# Altium project Pedaleira LPC2368.PrjPcb
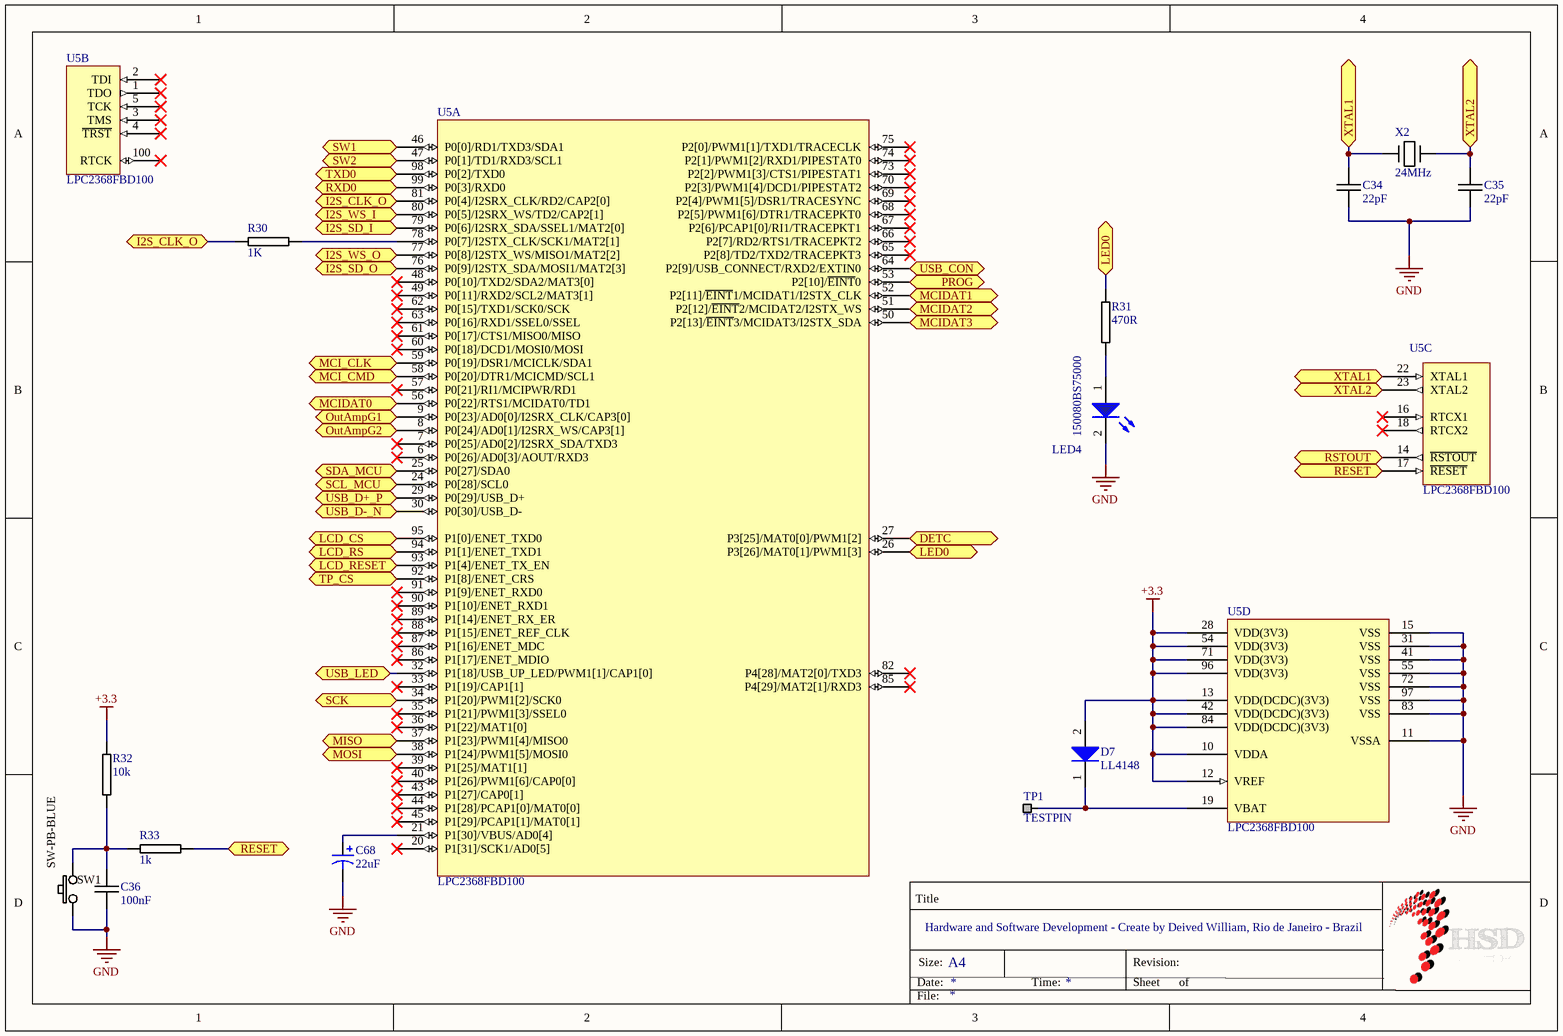
[diagram p0: MCU.SchDoc]
5 sheets, 121 parts. Net scope: flat (ports and power ports of the same name join across sheets).
Board file: PCB.PcbDoc
Sheets:
  MCU.SchDoc
  CODEC.SchDoc
  ISP.SchDoc
  LCD.SchDoc
  Alimentação.SchDoc

## Sheet MCU.SchDoc
size A4; Organization: Altium Limited; Address1: L3, 12a Rodborough Rd; Address2: Frenchs Forest; Address3: NSW; Address4: Australia 2086

### Parts
C34  22pF  [0603C-GENERIC]
C35  22pF  [0603C-GENERIC]
C36  100nF  [0603C-GENERIC]
C68  22uF  [D]
D7  LL4148  [MELFDIODE]
LED4  150080BS75000  [LED_0805_Blue]
R30  1K  [0603R-1k]
R31  470R  [0603R-1k]
R32  10k  [0603R-100]
R33  1k  [0603R-100]
SW1  SW-PB-BLUE  [SW-PB-BLUE-ROUND4]
TP1  TESTPIN  [TESTPIN]
U5  LPC2368FBD100  [SOT407-1_N]  (parts A,B,C,D of 4)
X2  24MHz  [XTAL-RU49/4]

### Ports
DETC, I2S_CLK_O, I2S_SD_I, I2S_SD_O, I2S_WS_I, I2S_WS_O, LCD_CS, LCD_RESET, LCD_RS, LED0, MCI_CLK, MCI_CMD, MCIDAT0, MCIDAT1, MCIDAT2, MCIDAT3, MISO, MOSI, OutAmpG1, OutAmpG2, PROG, RESET, RSTOUT, RXD0, SCK, SCL_MCU, SDA_MCU, SW1, SW2, TP_CS, TXD0, USB_CON, USB_D+_P, USB_D-_N, USB_LED, XTAL1, XTAL2

### Nets
+3.3: D7.2(A) R32.2 U5.10(VDDA) U5.12(VREF) U5.13(VDD(DCDC)(3V3)) U5.28(VDD(3V3)) U5.42(VDD(DCDC)(3V3)) U5.54(VDD(3V3)) U5.71(VDD(3V3)) U5.84(VDD(DCDC)(3V3)) U5.96(VDD(3V3))
GND: C34.2 C35.2 C36.2 C68.2 LED4.2(C) SW1.1 U5.11(VSSA) U5.15(VSS) U5.31(VSS) U5.41(VSS) U5.55(VSS) U5.72(VSS) U5.83(VSS) U5.97(VSS)
USB1_N: U5.30(P0[30]/USB_D-) ; port USB_D-_N
USB1_P: U5.29(P0[29]/USB_D+) ; port USB_D+_P
NetC34_1: C34.1 U5.22(XTAL1) X2.1 ; port XTAL1
NetC35_1: C35.1 U5.23(XTAL2) X2.2 ; port XTAL2
NetC36_1: C36.1 R32.1 R33.1 SW1.2
NetC63_1: U5.46(P0[0]/RD1/TXD3/SDA1) ; port SW1
NetC64_1: U5.47(P0[1]/TD1/RXD3/SCL1) ; port SW2
NetC68_1: C68.1 U5.21(P1[30]/VBUS/AD0[4])
NetD7_1: D7.1(K) TP1.1 U5.19(VBAT)
NetD9_2: U5.52(P2[11]/~{EINT}1/MCIDAT1/I2STX_CLK) ; port MCIDAT1
NetD10_2: U5.56(P0[22]/RTS1/MCIDAT0/TD1) ; port MCIDAT0
NetD11_2: U5.59(P0[19]/DSR1/MCICLK/SDA1) ; port MCI_CLK
NetD12_2: U5.58(P0[20]/DTR1/MCICMD/SCL1) ; port MCI_CMD
NetD13_2: U5.50(P2[13]/~{EINT}3/MCIDAT3/I2STX_SDA) ; port MCIDAT3
NetD14_2: U5.51(P2[12]/~{EINT}2/MCIDAT2/I2STX_WS) ; port MCIDAT2
NetJ1_11: U5.27(P3[25]/MAT0[0]/PWM1[2]) ; port DETC
NetLED1_2: U5.98(P0[2]/TXD0) ; port TXD0
NetLED2_2: U5.32(P1[18]/USB_UP_LED/PWM1[1]/CAP1[0]) ; port USB_LED
NetLED3_2: U5.99(P0[3]/RXD0) ; port RXD0
NetLED4_1: LED4.1(A) R31.2
NetP4_1: R33.2 U5.17(~{RESET}) ; port RESET
NetP4_3: U5.53(P2[10]/~{EINT}0) ; port PROG
NetP5_13: U5.93(P1[4]/ENET_TX_EN) ; port LCD_RESET
NetP5_15: U5.94(P1[1]/ENET_TXD1) ; port LCD_RS
NetP5_19: U5.38(P1[24]/PWM1[5]/MOSI0) ; port MOSI
NetP5_21: U5.37(P1[23]/PWM1[4]/MISO0) ; port MISO
NetP5_23: U5.34(P1[20]/PWM1[2]/SCK0) ; port SCK
NetP5_24: U5.95(P1[0]/ENET_TXD0) ; port LCD_CS
NetP5_26: U5.92(P1[8]/ENET_CRS) ; port TP_CS
NetR17_2: U5.25(P0[27]/SDA0) ; port SDA_MCU
NetR18_2: U5.24(P0[28]/SCL0) ; port SCL_MCU
NetR29_1: U5.64(P2[9]/USB_CONNECT/RXD2/EXTIN0) ; port USB_CON
NetR30_1: R30.1 U5.81(P0[4]/I2SRX_CLK/RD2/CAP2[0]) ; port I2S_CLK_O
NetR30_2: R30.2 U5.78(P0[7]/I2STX_CLK/SCK1/MAT2[1])
NetR31_1: R31.1 U5.26(P3[26]/MAT0[1]/PWM1[3]) ; port LED0
NetU3_6: U5.76(P0[9]/I2STX_SDA/MOSI1/MAT2[3]) ; port I2S_SD_O
NetU3_7: U5.77(P0[8]/I2STX_WS/MISO1/MAT2[2]) ; port I2S_WS_O
NetU3_8: U5.79(P0[6]/I2SRX_SDA/SSEL1/MAT2[0]) ; port I2S_SD_I
NetU3_9: U5.80(P0[5]/I2SRX_WS/TD2/CAP2[1]) ; port I2S_WS_I
NetU3_23: U5.8(P0[24]/AD0[1]/I2SRX_WS/CAP3[1]) ; port OutAmpG2
NetU3_24: U5.9(P0[23]/AD0[0]/I2SRX_CLK/CAP3[0]) ; port OutAmpG1
NetU4_19: U5.14(~{RSTOUT}) ; port RSTOUT

Not connected (* = marked no-connect by the designer): U5 1(TDO)* 2(TDI)* 3(TMS)* 4(~{TRST})* 5(TCK)* 6(P0[26]/AD0[3]/AOUT/RXD3)* 7(P0[25]/AD0[2]/I2SRX_SDA/TXD3)* 16(RTCX1)* 18(RTCX2)* 20(P1[31]/SCK1/AD0[5])* 33(P1[19]/CAP1[1])* 35(P1[21]/PWM1[3]/SSEL0)* 36(P1[22]/MAT1[0])* 39(P1[25]/MAT1[1])* 40(P1[26]/PWM1[6]/CAP0[0])* 43(P1[27]/CAP0[1])* 44(P1[28]/PCAP1[0]/MAT0[0])* 45(P1[29]/PCAP1[1]/MAT0[1])* 48(P0[10]/TXD2/SDA2/MAT3[0])* 49(P0[11]/RXD2/SCL2/MAT3[1])* 57(P0[21]/RI1/MCIPWR/RD1)* 60(P0[18]/DCD1/MOSI0/MOSI)* 61(P0[17]/CTS1/MISO0/MISO)* 62(P0[15]/TXD1/SCK0/SCK)* 63(P0[16]/RXD1/SSEL0/SSEL)* 65(P2[8]/TD2/TXD2/TRACEPKT3)* 66(P2[7]/RD2/RTS1/TRACEPKT2)* 67(P2[6]/PCAP1[0]/RI1/TRACEPKT1)* 68(P2[5]/PWM1[6]/DTR1/TRACEPKT0)* 69(P2[4]/PWM1[5]/DSR1/TRACESYNC)* 70(P2[3]/PWM1[4]/DCD1/PIPESTAT2)* 73(P2[2]/PWM1[3]/CTS1/PIPESTAT1)* 74(P2[1]/PWM1[2]/RXD1/PIPESTAT0)* 75(P2[0]/PWM1[1]/TXD1/TRACECLK)* 82(P4[28]/MAT2[0]/TXD3)* 85(P4[29]/MAT2[1]/RXD3)* 86(P1[17]/ENET_MDIO)* 87(P1[16]/ENET_MDC)* 88(P1[15]/ENET_REF_CLK)* 89(P1[14]/ENET_RX_ER)* 90(P1[10]/ENET_RXD1)* 91(P1[9]/ENET_RXD0)* 100(RTCK)*

### Notes on the sheet
- Title
- Date:
- Size:
- Hardware and Software Development - Create by Deived William, Rio de Janeiro - Brazil
- A4
- Time:
- Revision:
- Sheet
- of
- File:

### Library data of the parts
C34 C35 = 0603C-22PF-50V-C0G-PAN: CAPACITOR 0603 CERAMIC; Manufacturer Part Number: ECJ-1VC1H220J; Manufacturer: Panasonic - ECG; Reel: C10; Tolerance: ±5%; Temperature Coefficient: C0G, NP0; Voltage - Rated: 50V; Supplier 1: Digi-Key; Features: General Purpose; Lead Spacing: -; Supplier: Digi-Key; Capacitance: 22pF; Packaging: Tape & Reel (TR); Mounting Type: Surface Mount, MLCC; RoHS: RoHS Compliant; Operating Temperature: -55°C ~ 125°C; Thickness: 0.80mm; Package / Case: 0603 (1608 metric); Category: Capacitors; Supplier Part Number 1: PCC220ACVTR-ND; Supplier Part Number: PCC220ACVTR-ND
C36 = 0603C-100NF-25V-X7R-TDK: CAPACITOR 0603 CERAMIC; Manufacturer Part Number: C1608X7R1E104K; Manufacturer: TDK Corporation; Reel: C12; Supplier 1: Digi-Key; Supplier Part Number 1: 445-1316-2-ND
C68 = CC106D004M: Conformal Coated Solid Tantalum Chip Capacitor: Standard Range, 10uF, 20% Tolerance, 4 WVDC @ -55°C to +85°C, Surge = 5V; Note: See Data Sheet for full range of components; Published: 19-Mar-2004; DatasheetDocument: 21-Mar-2002; PackageReference: D; Publisher: Altium Limited; ComponentLink1Description: Manufacturer Link; ComponentLink1URL: http://www.vishay.com/; ComponentLink2Description: Datasheet; ComponentLink2URL: http://www.vishay.com/docs/43017/ccec.pdf; Value: 10uF
D7 = 1N4148: Small Signal Fast Switching Diode
LED4 = WL-SMCW 0805  150080BS75000: SMD mono-color Chip LED, WL-SMCW, Blue; Manufacturer: W黵th Elektronik eiSos GmbH; PartNo: 150080BS75000; ComponentLink1Description: Manufacturer; ComponentLink1URL: http://www.we-online.de; Created by: Christin Otto; Created Date: June 2013; ComponentLink2Description: Datasheet; ComponentLink2URL: http://katalog.we-online.com/led/datasheet/150080BS75000.pdf; Color: Blue
R30 R31 = 0603R-1K: GENERIC RESISTOR 0603; Manufacturer Part Number: RMCF 1/16 1K 1% R; Manufacturer: Stackpole Electronics Inc; Reel: R14; Supplier 1: Digi-Key; Supplier Part Number 1: RMCF0603FT1K00TR-ND
R32 R33 = 0603R-100: GENERIC RESISTOR 0603; Manufacturer Part Number: RMCF 1/16 100 1% R; Manufacturer: Stackpole Electronics Inc; Reel: R24; Supplier 1: Digi-Key; Supplier Part Number 1: RMCF1/16100FRDKR-ND
SW1 = SW-PB-BLUE: SW-D6-R / SW-DS-S / SW-14X14 / SW-7X7
TP1 = TESTPIN: TESTPIN SINGLE PIN HEADER; Manufacturer 1: Sharon Long Industries; Manufacturer Part Number 1: Cut-it-yourself; Reel: TH; Supplier 1: Sharon Long Industries; Supplier 1 Part number: Cut-It-Yourself
U5 = LPC2368FBD100: ARM7 16/32-Bit Microcontroller, 512KB Flash, 58KB RAM, 4 Channel CAN, 100-Lead LQFP; Code_IEC: 136E20; Published: 17-Aug-2007; DatasheetVersion: rev.01, Jan-2007; PackageVersion: Feb-2003; PackageReference: SOT407-1; Publisher: Altium Limited; PackageDescription: 100-Pin Plastic Low Profile Quad Flat Pack, LQFP100; Code_JEDEC: MS-026; ComponentLink1Description: Manufacturer Link; ComponentLink1URL: http://www.nxp.com/; ComponentLink2Description: Datasheet; ComponentLink2URL: http://www.standardics.nxp.com/products/lpc2000/datasheet/lpc2364.lpc2366.lpc2368.pdf
X2 = 16MC-HC49US: 16MHZ CRSYTAL HC49US; Supplier 1: Mouser; Supplier Part Number 1: 815-ABLS-16.0M-T

## Sheet CODEC.SchDoc
size A4; Organization: Altium Limited; Address1: L3, 12a Rodborough Rd; Address2: Frenchs Forest; Address3: NSW; Address4: Australia 2086
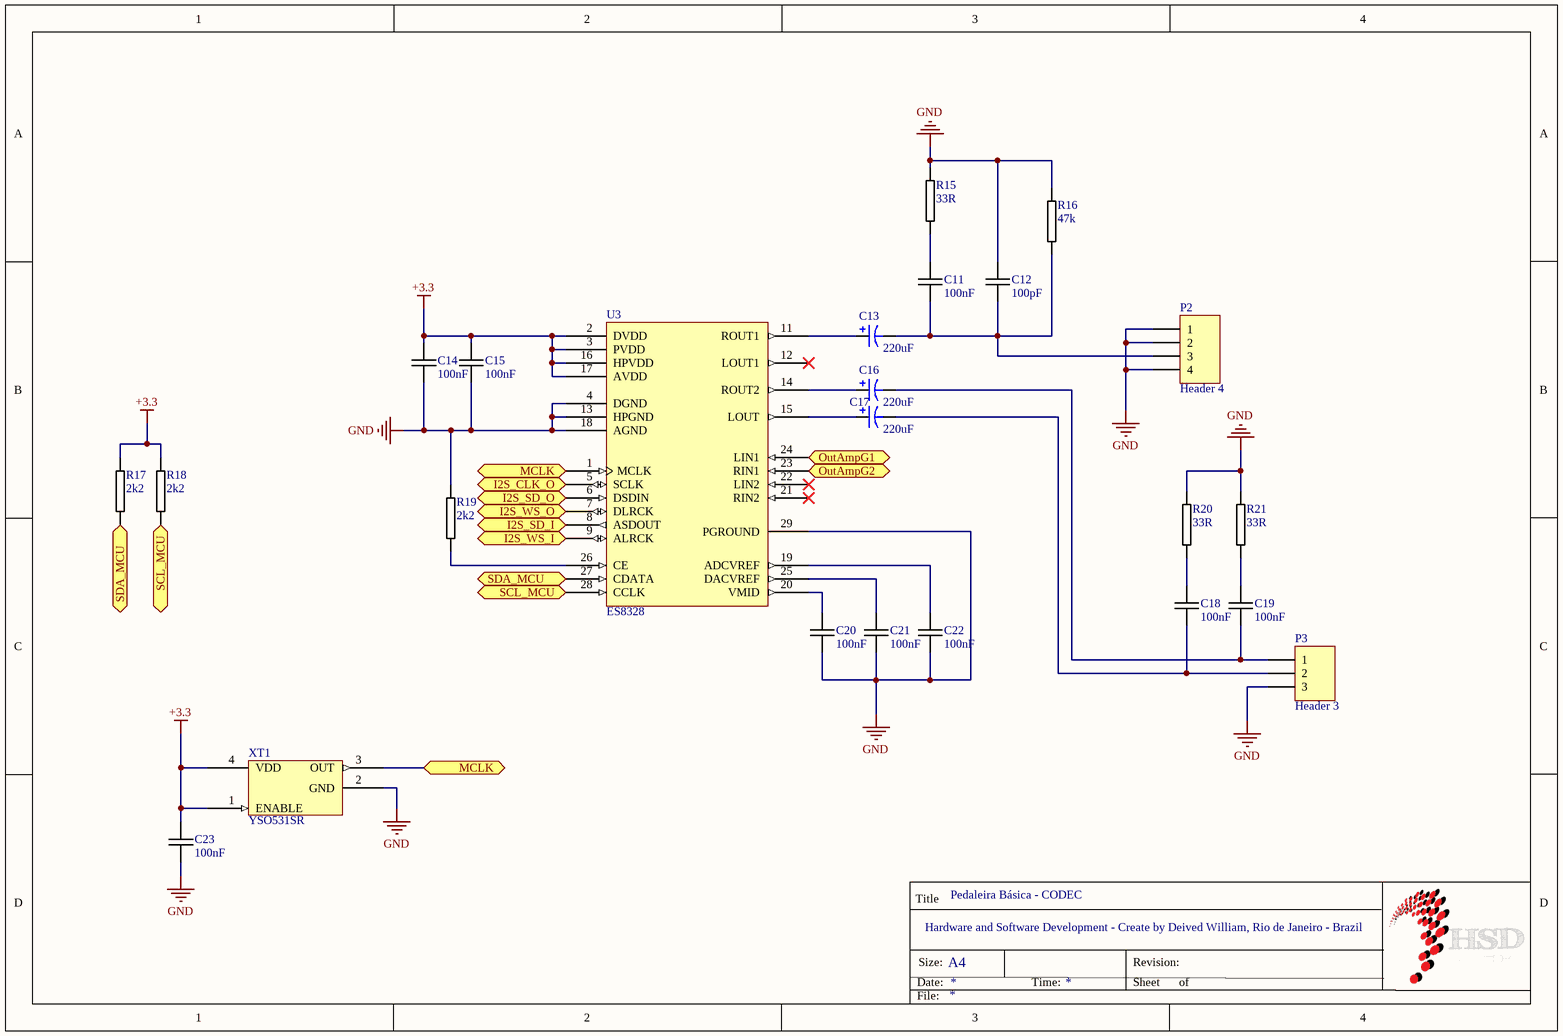
[diagram p1: CODEC.SchDoc]

### Parts
C11  100nF  [0603C-GENERIC]
C12  100pF  [0603C-GENERIC]
C13  220uF  [D]
C14  100nF  [0603C-GENERIC]
C15  100nF  [0603C-GENERIC]
C16  220uF  [D]
C17  220uF  [D]
C18  100nF  [0603C-GENERIC]
C19  100nF  [0603C-GENERIC]
C20  100nF  [0603C-GENERIC]
C21  100nF  [0603C-GENERIC]
C22  100nF  [0603C-GENERIC]
C23  100nF  [0603C-GENERIC]
P2  Header 4  [JACK P10 PLUG]
P3  Header 3  [HDR1X3]
R15  33R  [0603R-100]
R16  47k  [0603R-100]
R17  2k2  [0603R-100]
R18  2k2  [0603R-100]
R19  2k2  [0603R-100]
R20  33R  [0603R-100]
R21  33R  [0603R-100]
U3  ES8328  [QFN-28L]
XT1  YSO531SR  [CRISTAL]

### Ports
I2S_CLK_O, I2S_SD_I, I2S_SD_O, I2S_WS_I, I2S_WS_O, MCLK, OutAmpG1, OutAmpG2, SCL_MCU, SDA_MCU

### Nets
+3.3: C14.1 C15.1 C23.1 R17.1 R18.1 U3.2(DVDD) U3.3(PVDD) U3.16(HPVDD) U3.17(AVDD) XT1.1(ENABLE) XT1.4(VDD)
GND: C12.1 C14.2 C15.2 C20.2 C21.2 C22.2 C23.2 P2.1 P2.2 P2.4 P3.3 R15.1 R16.1 R19.2 R20.1 R21.1 U3.4(DGND) U3.13(HPGND) U3.18(AGND) U3.29(PGROUND) XT1.2(GND)
NetC11_1: C11.1 R15.2
NetC11_2: C11.2 C12.2 C13.2 P2.3 R16.2
NetC13_1: C13.1 U3.11(ROUT1)
NetC16_1: C16.1 U3.14(ROUT2)
NetC16_2: C16.2 C19.2 P3.1
NetC17_1: C17.1 U3.15(LOUT)
NetC17_2: C17.2 C18.2 P3.2
NetC18_1: C18.1 R20.2
NetC19_1: C19.1 R21.2
NetC20_1: C20.1 U3.20(VMID)
NetC21_1: C21.1 U3.25(DACVREF)
NetC22_1: C22.1 U3.19(ADCVREF)
NetR17_2: R17.2 U3.27(CDATA) ; port SDA_MCU
NetR18_2: R18.2 U3.28(CCLK) ; port SCL_MCU
NetR19_1: R19.1 U3.26(CE)
NetR30_1: U3.5(SCLK) ; port I2S_CLK_O
NetU3_1: U3.1(MCLK) XT1.3(OUT) ; port MCLK
NetU3_6: U3.6(DSDIN) ; port I2S_SD_O
NetU3_7: U3.7(DLRCK) ; port I2S_WS_O
NetU3_8: U3.8(ASDOUT) ; port I2S_SD_I
NetU3_9: U3.9(ALRCK) ; port I2S_WS_I
NetU3_23: U3.23(RIN1) ; port OutAmpG2
NetU3_24: U3.24(LIN1) ; port OutAmpG1

Not connected (* = marked no-connect by the designer): U3 12(LOUT1)* 21(RIN2)* 22(LIN2)*

### Notes on the sheet
- Pedaleira Básica - CODEC
- Title
- Date:
- Size:
- Hardware and Software Development - Create by Deived William, Rio de Janeiro - Brazil
- A4
- Time:
- Revision:
- Sheet
- of
- File:

### Library data of the parts
C11 C12 C14 C15 C18-C23 = 0603C-100NF-25V-X7R-TDK: as C36 on sheet MCU; Supplier 1: Digi-Key; Supplier Part Number 1: 445-1316-2-ND
C13 C16 C17 = CC106D004M: as C68 on sheet MCU; Published: 19-Mar-2004; DatasheetDocument: 21-Mar-2002; PackageReference: D; Publisher: Altium Limited; ComponentLink1Description: Manufacturer Link; ComponentLink1URL: http://www.vishay.com/; ComponentLink2Description: Datasheet; ComponentLink2URL: http://www.vishay.com/docs/43017/ccec.pdf; Value: 10uF
P2 = Header 4: Header, 4-Pin; LatestRevisionDate: 17-Jul-2002; LatestRevisionNote: Re-released for DXP Platform.; Publisher: Altium Limited
P3 = Header 3: Header, 3-Pin; LatestRevisionDate: 17-Jul-2002; LatestRevisionNote: Re-released for DXP Platform.; Publisher: Altium Limited
R15-R21 = 0603R-100: as R32 on sheet MCU; Supplier 1: Digi-Key; Supplier Part Number 1: RMCF1/16100FRDKR-ND
U3 = ES8328: Low Power Estereo Audio Codec With HeadPhone Amplifier
XT1 = YSO531SR: Cristal Oscilator Active 1.8v - 3.3v

## Sheet ISP.SchDoc
size A4; Organization: Altium Limited; Address1: L3, 12a Rodborough Rd; Address2: Frenchs Forest; Address3: NSW; Address4: Australia 2086
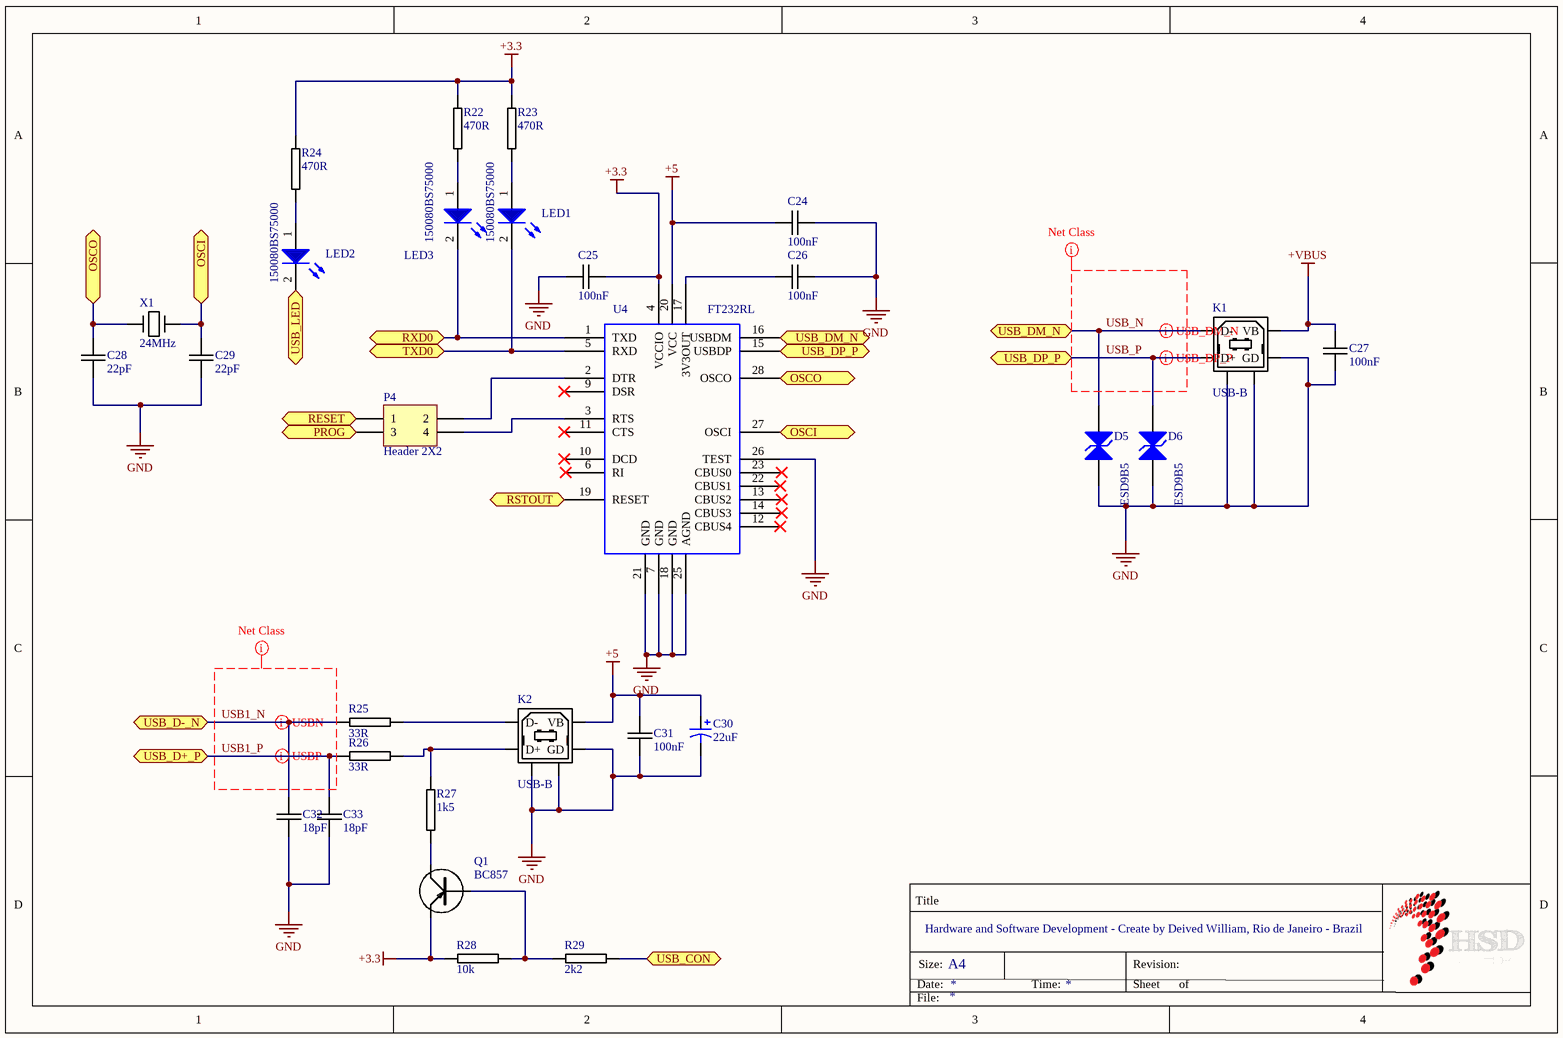
[diagram p2: ISP.SchDoc]

### Parts
C24  100nF  [0603C-GENERIC]
C25  100nF  [0603C-GENERIC]
C26  100nF  [0603C-GENERIC]
C27  100nF  [0603C-GENERIC]
C28  22pF  [0603C-GENERIC]
C29  22pF  [0603C-GENERIC]
C30  22uF  [D]
C31  100nF  [0603C-GENERIC]
C32  18pF  [0603C-GENERIC]
C33  18pF  [0603C-GENERIC]
D5  ESD9B5  [SOD-923]
D6  ESD9B5  [SOD-923]
K1  USB-B  [USB-B]
K2  USB-B  [USB-B]
LED1  150080BS75000  [LED_0805_Blue]
LED2  150080BS75000  [LED_0805_Blue]
LED3  150080BS75000  [LED_0805_Blue]
P4  Header 2X2  [HDR2X2]
Q1  BC857  [SOT23-BCE]
R22  470R  [0603R-1k]
R23  470R  [0603R-1k]
R24  470R  [0603R-1k]
R25  33R  [0603R-1k]
R26  33R  [0603R-1k]
R27  1k5  [0603R-1k]
R28  10k  [0603R-1k]
R29  2k2  [0603R-1k]
U4  FT232RL  [TSSOP28]
X1  24MHz  [XTAL-RU49/4]

### Ports
OSCI, OSCO, PROG, RESET, RSTOUT, RXD0, TXD0, USB_CON, USB_D+_P, USB_D-_N, USB_DM_N, USB_DP_P, USB_LED

### Nets
+3.3: C25.2 Q1.E R22.1 R23.1 R24.1 R28.2 U4.4(VCCIO)
+5: C24.2 C30.1 C31.1 K2.1(VB) U4.20(VCC)
+VBUS: C27.1 K1.1(VB)
GND: C24.1 C25.1 C26.1 C27.2 C28.2 C29.2 C30.2 C31.2 C32.2 C33.2 D5.1 D6.1 K1.4(GD) K1.5 K1.6 K2.4(GD) K2.5 K2.6 U4.7(GND) U4.18(GND) U4.21(GND) U4.25(AGND) U4.26(TEST)
USB1_N: C32.1 R25.1 ; port USB_D-_N
USB1_P: C33.1 R26.1 ; port USB_D+_P
USB_N: D5.2 K1.2(D-) U4.16(USBDM) ; port USB_DM_N
USB_P: D6.2 K1.3(D+) U4.15(USBDP) ; port USB_DP_P
NetC26_2: C26.2 U4.17(3V3OUT)
NetC28_1: C28.1 U4.28(OSCO) X1.1 ; port OSCO
NetC29_1: C29.1 U4.27(OSCI) X1.2 ; port OSCI
NetK2_2: K2.2(D-) R25.2
NetK2_3: K2.3(D+) R26.2 R27.2
NetLED1_1: LED1.1(A) R23.2
NetLED1_2: LED1.2(C) U4.5(RXD) ; port TXD0
NetLED2_1: LED2.1(A) R24.2
NetLED2_2: LED2.2(C) ; port USB_LED
NetLED3_1: LED3.1(A) R22.2
NetLED3_2: LED3.2(C) U4.1(TXD) ; port RXD0
NetP4_1: P4.1 ; port RESET
NetP4_2: P4.2 U4.2(DTR)
NetP4_3: P4.3 ; port PROG
NetP4_4: P4.4 U4.3(RTS)
NetQ1_B: Q1.B R28.1 R29.2
NetQ1_C: Q1.C R27.1
NetR29_1: R29.1 ; port USB_CON
NetU4_19: U4.19(RESET) ; port RSTOUT

Not connected (* = marked no-connect by the designer): U4 6(RI) 9(DSR)* 10(DCD)* 11(CTS)* 12(CBUS4)* 13(CBUS2) 14(CBUS3) 22(CBUS1)* 23(CBUS0)

### Layout directives
net class Undefined: USB1_N, USB1_P, USB_N, USB_P
differential pair; rule Undefined; rule Differential Pairs Routing [Pref Gap = 10mil    Min Gap  = 10mil    Max Gap  = 10milPref Width = 15mil    Min Width  = 15mil    Max Width  = 15mil]; rule Differential Pairs Routing [Pref Gap = 0.254mm    Min Gap  = 0.254mm    Max Gap  = 0.254mmPref Width = 0.381mm    Min Width  = 0.381mm    Max Width  = 0.381mm]: USB_N
differential pair; rule Differential Pairs Routing [Pref Gap = 10mil    Min Gap  = 10mil    Max Gap  = 10milPref Width = 15mil    Min Width  = 15mil    Max Width  = 15mil]; rule Differential Pairs Routing [Pref Gap = 10mil    Min Gap  = 10mil    Max Gap  = 10milPref Width = 15mil    Min Width  = 15mil    Max Width  = 15mil]: USB_P
differential pair; rule Differential Pairs Routing [Pref Gap = 10mil    Min Gap  = 10mil    Max Gap  = 10milPref Width = 15mil    Min Width  = 15mil    Max Width  = 15mil]; : USB_D-_N; rule Differential Pairs Routing [Pref Gap = 0.254mm    Min Gap  = 0.254mm    Max Gap  = 0.254mmPref Width = 0.381mm    Min Width  = 0.381mm    Max Width  = 0.381mm]: USB1_N
differential pair; rule Differential Pairs Routing [Pref Gap = 10mil    Min Gap  = 10mil    Max Gap  = 10milPref Width = 15mil    Min Width  = 15mil    Max Width  = 15mil]; : USB_D+_P; rule Differential Pairs Routing [Pref Gap = 0.254mm    Min Gap  = 0.254mm    Max Gap  = 0.254mmPref Width = 0.381mm    Min Width  = 0.381mm    Max Width  = 0.381mm]: USB1_P

### Notes on the sheet
- Title
- Date:
- Size:
- Hardware and Software Development - Create by Deived William, Rio de Janeiro - Brazil
- A4
- Time:
- Revision:
- Sheet
- of
- File:

### Library data of the parts
C24-C26 C31-C33 = 0603C-22PF-50V-C0G-PAN: CAPACITOR 0603 CERAMIC; Manufacturer Part Number: ECJ-1VC1H220J; Manufacturer: Panasonic - ECG; Reel: C10; Tolerance: ±5%; Capacitance: 22pF; Temperature Coefficient: C0G, NP0; Voltage - Rated: 50V; Supplier 1: Digi-Key; Features: General Purpose; Lead Spacing: -; Supplier: Digi-Key; Packaging: Tape & Reel (TR); Mounting Type: Surface Mount, MLCC; RoHS: RoHS Compliant; Operating Temperature: -55°C ~ 125°C; Thickness: 0.80mm; Package / Case: 0603 (1608 metric); Category: Capacitors; Supplier Part Number 1: PCC220ACVTR-ND; Supplier Part Number: PCC220ACVTR-ND
C27 = 0603C-100NF-25V-X7R-TDK: as C36 on sheet MCU; Supplier 1: Digi-Key; Supplier Part Number 1: 445-1316-2-ND
C28 C29 = 0603C-22PF-50V-C0G-PAN: as C34 on sheet MCU; Supplier 1: Digi-Key; Features: General Purpose; Lead Spacing: -; Supplier: Digi-Key; Capacitance: 22pF; Packaging: Tape & Reel (TR); Mounting Type: Surface Mount, MLCC; RoHS: RoHS Compliant; Operating Temperature: -55°C ~ 125°C; Thickness: 0.80mm; Package / Case: 0603 (1608 metric); Category: Capacitors; Supplier Part Number 1: PCC220ACVTR-ND; Supplier Part Number: PCC220ACVTR-ND
C30 = CC106D004M: as C68 on sheet MCU; Published: 19-Mar-2004; DatasheetDocument: 21-Mar-2002; PackageReference: D; Publisher: Altium Limited; ComponentLink1Description: Manufacturer Link; ComponentLink1URL: http://www.vishay.com/; ComponentLink2Description: Datasheet; ComponentLink2URL: http://www.vishay.com/docs/43017/ccec.pdf; Value: 10uF
D5 D6 = ESD9B5: ESD PROTECTION DIODE
K1 K2 = USB-B: USB B DEVICE CONNECTOR; Text Field1: Assmann; Text Field2: AU-Y1007; Text Field3: Digi-Key; Text Field4: AE1085-ND; Text Field5: Thru-Hole; Text Field6: 1.168; NI?: *; O?: *; Section:: *
LED1-LED3 = WL-SMCW 0805  150080BS75000: as LED4 on sheet MCU; PartNo: 150080BS75000; ComponentLink1Description: Manufacturer; ComponentLink1URL: http://www.we-online.de; Created by: Christin Otto; Created Date: June 2013; ComponentLink2Description: Datasheet; ComponentLink2URL: http://katalog.we-online.com/led/datasheet/150080BS75000.pdf; Color: Blue
P4 = Header 2X2: Header, 2-Pin, Dual row; LatestRevisionDate: 17-Jul-2002; LatestRevisionNote: Re-released for DXP Platform.; Publisher: Altium Limited
Q1 = BC857: BC857 SMALL SIGNAL PNP BIPOLAR TRANSISTOR; Manufacturer: Diodes Inc; Manufacturer Part Number: BC857C-7-F; Vce Saturation (Max) @ Ib, Ic: 650mV @ 5mA, 100mA; Current - Collector (Ic) (Max): 100mA; Voltage - Collector Emitter Breakdown (Max): 45V; Frequency - Transition: 200MHz; Power - Max: 300mW; DC Current Gain (hFE) (Min) @ Ic, Vce: 420 @ 2mA, 5V; Current - Collector Cutoff (Max): 15nA; Supplier 1: Digi-Key; Supplier Part Number 1: BC857C-FDICT-ND; Mounting Type: Surface Mount; Packaging: Cut Tape (CT); Package / Case: SOT-23-3, TO-236-3, Micro3™, SSD3, SST3; Transistor Type: PNP; RoHS: RoHS Compliant; Supplier: Digi-Key; Supplier Part Number: BC857C-FDICT-ND; Category: Discrete Semiconductor Products
R22-R29 = 0603R-1K: as R30 on sheet MCU; Supplier 1: Digi-Key; Supplier Part Number 1: RMCF0603FT1K00TR-ND
U4 = FT232RL: USB TO UART INTERFACE; Manufacturer: FTDI, Future Technology Devices International Ltd; Manufacturer Part Number: FT232RL R; Number of Channels: 8; Voltage: 3.3 V ~ 5.25 V; FIFO's: 256 Byte; Supplier 1: Digi-Key; Supplier Part Number 1: 768-1007-2-ND; RoHS: RoHS Compliant; Features: Serial Interface; Package / Case: 28-SSOP; Supplier: Digi-Key; Packaging: Tape & Reel (TR); Supplier Part Number: 768-1007-2-ND; Category: Integrated Circuits (ICs)
X1 = 16MC-HC49US: 16MHZ CRSYTAL HC49US; Supplier 1: Mouser; Supplier Part Number 1: 815-ABLS-16.0M-T

## Sheet LCD.SchDoc
size A4; Organization: Altium Limited; Address1: L3, 12a Rodborough Rd; Address2: Frenchs Forest; Address3: NSW; Address4: Australia 2086
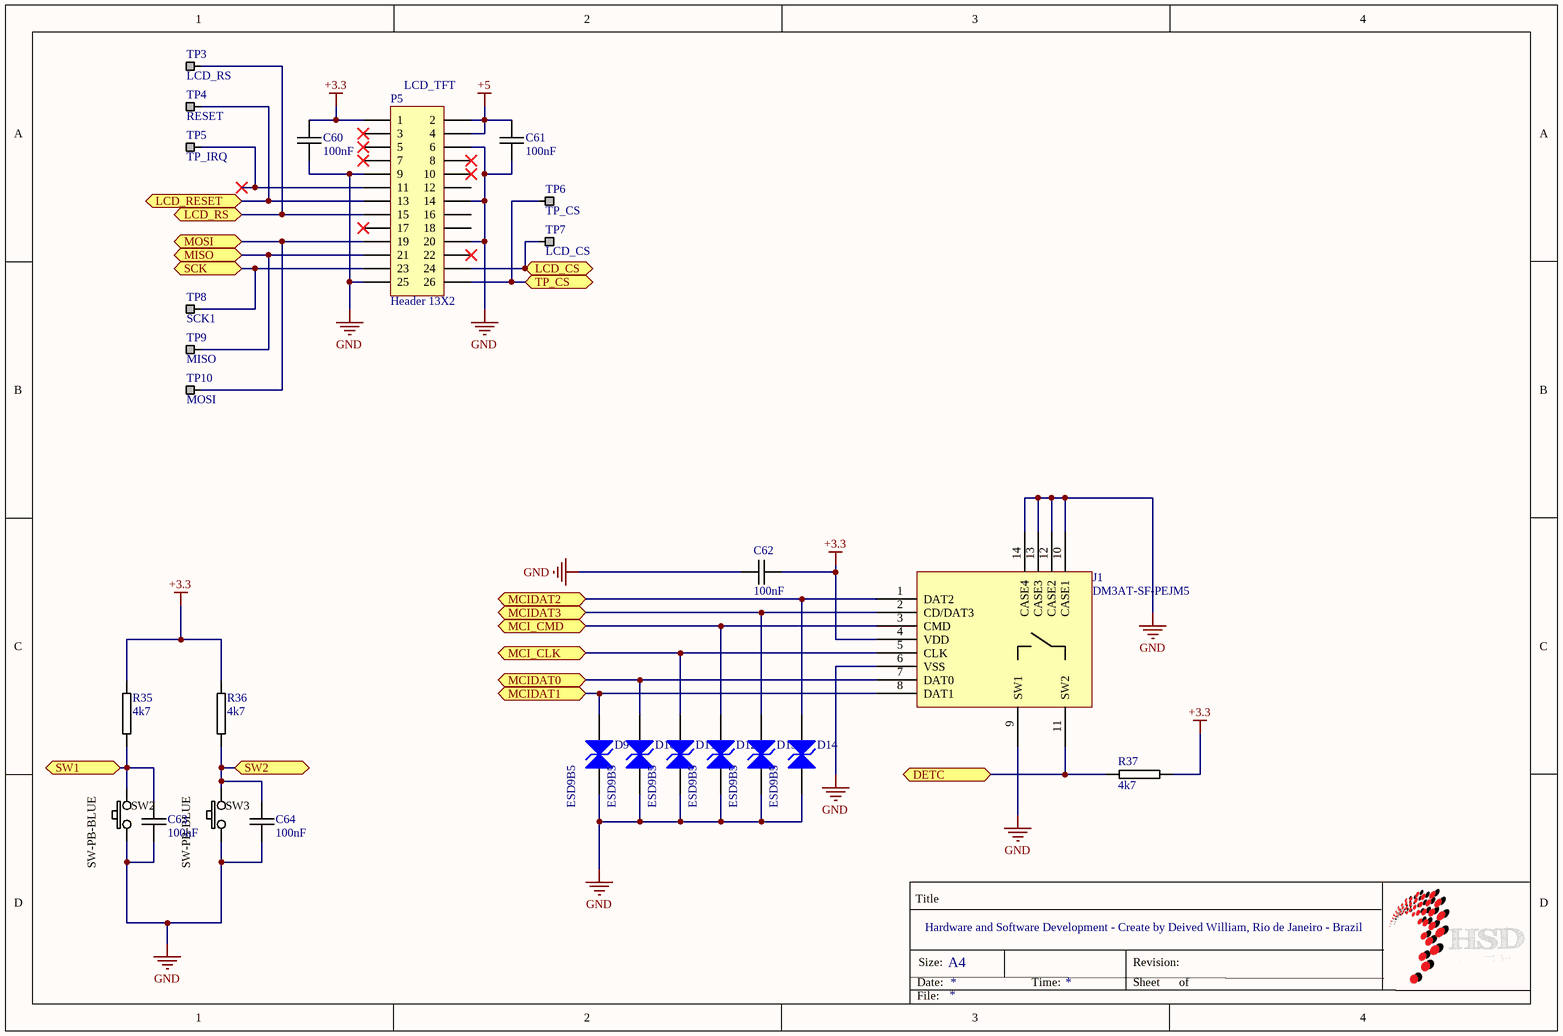
[diagram p3: LCD.SchDoc]

### Parts
C60  100nF  [0603C-GENERIC]
C61  100nF  [0603C-GENERIC]
C62  100nF  [0603C-GENERIC]
C63  100nF  [0603C-GENERIC]
C64  100nF  [0603C-GENERIC]
D9  ESD9B5  [SOD-923]
D10  ESD9B5  [SOD-923]
D11  ESD9B5  [SOD-923]
D12  ESD9B5  [SOD-923]
D13  ESD9B5  [SOD-923]
D14  ESD9B5  [SOD-923]
J1  DM3AT-SF-PEJM5  [SD CARD MICRO]
P5  Header 13X2  [HDR2X13]
R35  4k7  [0603R-100]
R36  4k7  [0603R-100]
R37  4k7  [0603R-100]
SW2  SW-PB-BLUE  [SW-PB-BLUE-ROUND4]
SW3  SW-PB-BLUE  [SW-PB-BLUE-ROUND4]
TP3  LCD_RS  [TESTPIN]
TP4  RESET  [TESTPIN]
TP5  TP_IRQ  [TESTPIN]
TP6  TP_CS  [TESTPIN]
TP7  LCD_CS  [TESTPIN]
TP8  SCK1  [TESTPIN]
TP9  MISO  [TESTPIN]
TP10  MOSI  [TESTPIN]

### Ports
DETC, LCD_CS, LCD_RESET, LCD_RS, MCI_CLK, MCI_CMD, MCIDAT0, MCIDAT1, MCIDAT2, MCIDAT3, MISO, MOSI, SCK, SW1, SW2, TP_CS

### Nets
+3.3: C60.1 C62.2 J1.4(VDD) P5.1 R35.2 R36.2 R37.2
+5: C61.1 P5.2 P5.4
GND: C60.2 C61.2 C62.1 C63.2 C64.2 D9.1 D10.1 D11.1 D12.1 D13.1 D14.1 J1.6(VSS) J1.9(SW1) J1.10(CASE1) J1.12(CASE2) J1.13(CASE3) J1.14(CASE4) P5.6 P5.9 P5.14 P5.20 P5.25 SW2.1 SW3.1
NetC63_1: C63.1 R35.1 SW2.2 ; port SW1
NetC64_1: C64.1 R36.1 SW3.2 ; port SW2
NetD9_2: D9.2 J1.8(DAT1) ; port MCIDAT1
NetD10_2: D10.2 J1.7(DAT0) ; port MCIDAT0
NetD11_2: D11.2 J1.5(CLK) ; port MCI_CLK
NetD12_2: D12.2 J1.3(CMD) ; port MCI_CMD
NetD13_2: D13.2 J1.2(CD/DAT3) ; port MCIDAT3
NetD14_2: D14.2 J1.1(DAT2) ; port MCIDAT2
NetJ1_11: J1.11(SW2) R37.1 ; port DETC
NetP5_11: P5.11 TP5.1
NetP5_13: P5.13 TP4.1 ; port LCD_RESET
NetP5_15: P5.15 TP3.1 ; port LCD_RS
NetP5_19: P5.19 TP10.1 ; port MOSI
NetP5_21: P5.21 TP9.1 ; port MISO
NetP5_23: P5.23 TP8.1 ; port SCK
NetP5_24: P5.24 TP7.1 ; port LCD_CS
NetP5_26: P5.26 TP6.1 ; port TP_CS

Not connected (* = marked no-connect by the designer): P5 3* 5* 7* 8* 10* 12 16 17* 18 22*

### Notes on the sheet
- (near P5) LCD_TFT
- Title
- Date:
- Size:
- Hardware and Software Development - Create by Deived William, Rio de Janeiro - Brazil
- A4
- Time:
- Revision:
- Sheet
- of
- File:

### Library data of the parts
C60-C64 = 0603C-100NF-25V-X7R-TDK: as C36 on sheet MCU; Supplier 1: Digi-Key; Supplier Part Number 1: 445-1316-2-ND
D9-D14 = ESD9B5: ESD PROTECTION DIODE
J1 = DM3AT-SF-PEJM5: Conector micro SD push/push
P5 = Header 13X2: Header, 13-Pin, Dual row; LatestRevisionDate: 17-Jul-2002; LatestRevisionNote: Re-released for DXP Platform.; Publisher: Altium Limited
R35-R37 = 0603R-100: as R32 on sheet MCU; Supplier 1: Digi-Key; Supplier Part Number 1: RMCF1/16100FRDKR-ND
SW2 SW3 = SW-PB-BLUE: SW-D6-R / SW-DS-S / SW-14X14 / SW-7X7
TP3-TP10 = TESTPIN: as TP1 on sheet MCU; Supplier 1: Sharon Long Industries; Supplier 1 Part number: Cut-It-Yourself

## Sheet Alimentação.SchDoc
size A4; Organization: Altium Limited; Address1: L3, 12a Rodborough Rd; Address2: Frenchs Forest; Address3: NSW; Address4: Australia 2086
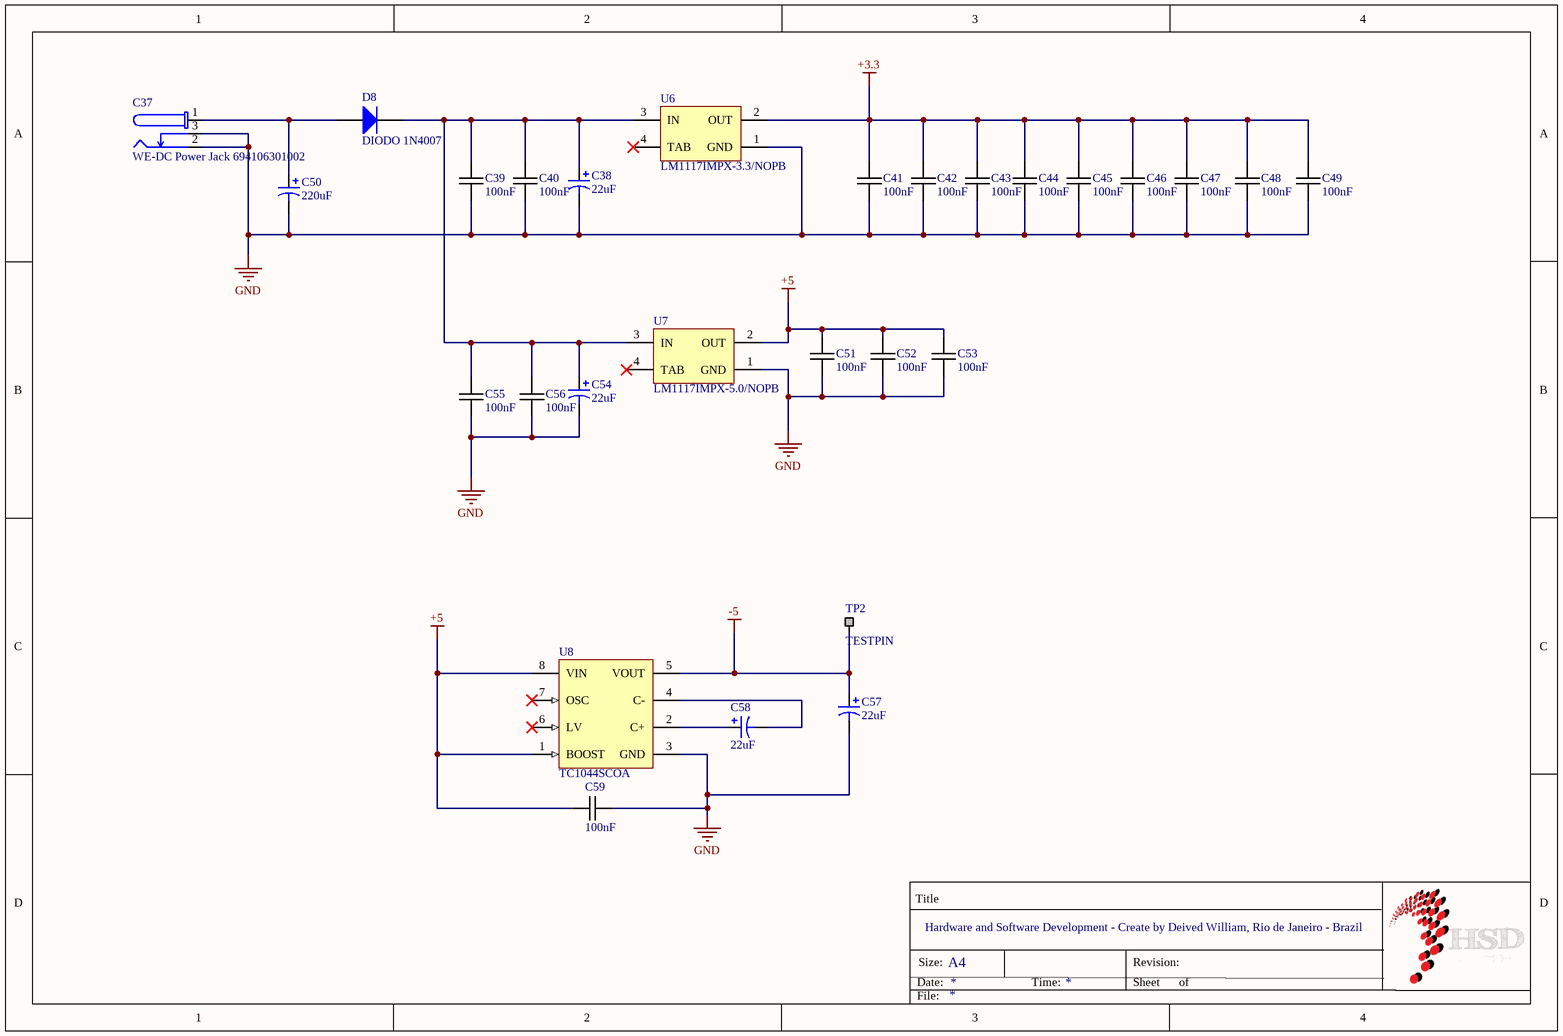
[diagram p4: Alimentação.SchDoc]

### Parts
C37  WE-DC Power Jack 694106301002  [694106301002]
C38  22uF  [D]
C39  100nF  [0603C-GENERIC]
C40  100nF  [0603C-GENERIC]
C41  100nF  [0603C-GENERIC]
C42  100nF  [0603C-GENERIC]
C43  100nF  [0603C-GENERIC]
C44  100nF  [0603C-GENERIC]
C45  100nF  [0603C-GENERIC]
C46  100nF  [0603C-GENERIC]
C47  100nF  [0603C-GENERIC]
C48  100nF  [0603C-GENERIC]
C49  100nF  [0603C-GENERIC]
C50  220uF  [D]
C51  100nF  [0603C-GENERIC]
C52  100nF  [0603C-GENERIC]
C53  100nF  [0603C-GENERIC]
C54  22uF  [D]
C55  100nF  [0603C-GENERIC]
C56  100nF  [0603C-GENERIC]
C57  22uF  [D]
C58  22uF  [D]
C59  100nF  [0603C-GENERIC]
D8  DIODO 1N4007  [DO-41]
TP2  TESTPIN  [TESTPIN]
U6  LM1117IMPX-3.3/NOPB  [MP04A_N]
U7  LM1117IMPX-5.0/NOPB  [MP04A_N]
U8  TC1044SCOA  [SOIC-OA8_N]

### Nets
+3.3: C41.1 C42.1 C43.1 C44.1 C45.1 C46.1 C47.1 C48.1 C49.1 U6.2(OUT)
+5: C51.1 C52.1 C53.1 C59.1 U7.2(OUT) U8.1(BOOST) U8.8(VIN)
-5: C57.1 TP2.1 U8.5(VOUT)
GND: C37.2 C37.3 C38.2 C39.2 C40.2 C41.2 C42.2 C43.2 C44.2 C45.2 C46.2 C47.2 C48.2 C49.2 C50.2 C51.2 C52.2 C53.2 C54.2 C55.2 C56.2 C57.2 C59.2 U6.1(GND) U7.1(GND) U8.3(GND)
NetC37_1: C37.1 C50.1 D8.1(A)
NetC38_1: C38.1 C39.1 C40.1 C54.1 C55.1 C56.1 D8.2(K) U6.3(IN) U7.3(IN)
NetC58_1: C58.1 U8.2(C+)
NetC58_2: C58.2 U8.4(C-)

Not connected (* = marked no-connect by the designer): U6 4(TAB)*; U7 4(TAB)*; U8 6(LV)* 7(OSC)*

### Notes on the sheet
- Title
- Date:
- Size:
- Hardware and Software Development - Create by Deived William, Rio de Janeiro - Brazil
- A4
- Time:
- Revision:
- Sheet
- of
- File:

### Library data of the parts
C37 = WE-DC Power Jack 694106301002: WR-DC_DC Power Jack_Right Angled_THT; Manufacturer: W¨¹rth Elektronik eiSos GmbH; ComponentLink1 Description: Manufacturer; ComponentLink2 Description: Datasheet; NoPins: 3; ComponentLink1URL: http://www.we-online.de; ComponentLink2URL: http://katalog.we-online.de/em/datasheet/6941xx301002.pdf; Created by: Karrer Zheng; Created Date: 10/17/2014; partNo: 694106301002
C38 C50 C54 C57 C58 = CC106D004M: as C68 on sheet MCU; Published: 19-Mar-2004; DatasheetDocument: 21-Mar-2002; PackageReference: D; Publisher: Altium Limited; ComponentLink1Description: Manufacturer Link; ComponentLink1URL: http://www.vishay.com/; ComponentLink2Description: Datasheet; ComponentLink2URL: http://www.vishay.com/docs/43017/ccec.pdf; Value: 10uF
C39-C49 C51-C53 C55 C56 C59 = 0603C-100NF-50V-X7R-TDK: CAPACITOR 0603 CERAMIC; Manufacturer Part Number: C1608X7R1H103K; Manufacturer: TDK Corporation; Temperature Coefficient: X7R; Tolerance: ±10%; Voltage - Rated: 50V; Capacitance: 10000pF; Reel: C68; RoHS: RoHS Compliant; Lead Spacing: -; Package / Case: 0603 (1608 metric); Features: General Purpose; Packaging: Tape & Reel (TR); Thickness: 0.80mm; Operating Temperature: -55°C ~ 125°C; Mounting Type: Surface Mount, MLCC; Category: Capacitors; Supplier 1: Digi-Key; Supplier Part Number 1: 445-1314-2-ND
D8 = DIODO 1N4007: 1 Amp General Purpose Rectifier; Published: 8-Jun-2000; LatestRevisionDate: 17-Jul-2002; LatestRevisionNote: Re-released for DXP Platform.; DatasheetVersion: 1998; PackageVersion: Aug-1999; PackageReference: DO-41; Publisher: Altium Limited; PackageDescription: Diode, Axial; Body 5.2 x 2.7 mm (LxDia. max), Lead Dia. 0.86 mm (max); Code_JEDEC: DO-204-AL; ComponentLink1Description: Manufacturer Link; ComponentLink1URL: http://www.fairchildsemi.com/; ComponentLink2Description: Datasheet; ComponentLink2URL: http://www.fairchildsemi.com/ds/1N%2F1N4001.pdf
TP2 = TESTPIN: as TP1 on sheet MCU; Supplier 1: Sharon Long Industries; Supplier 1 Part number: Cut-It-Yourself
U6 = LM1117IMPX-3.3/NOPB: 800mA Low-Dropout Linear Regulator, 4-pin SOT-223, Pb-Free; Manufacturer: National Semiconductor; PackageTopMarking: XYTT*N05B; PowerWise: N; CompType: LDO IC; Published: 1-Mar-2010; DatasheetVersion: Apr-2006; PackageVersion: revB, Apr-2003; PackageReference: MP04A; Publisher: Altium Limited; PackageDescription: Molded SOT-223, 6.50 x 3.56 x 1.6mm Body, 4 Lead, 2.3mm Pitch; Supplier 1: Digi-Key; Supplier Part Number 1: LM1117IMPX-3.3-ND; PartNumber: LM1117IMPX-3.3/NOPB; RoHS: Y; PinCount: 4; Code_JEDEC: TO-261-AA; Code_IPC: SOT223-4; ComponentLink1Description: LM1117 Datasheet; ComponentLink1URL: http://www.national.com/ds/LM/LM1117.pdf; ComponentLink2Description: LM1117 Web Page; ComponentLink2URL: http://www.national.com/pf/LM/LM1117.html; ComponentLink3Description: MP04A Package Page; ComponentLink3URL: http://www.national.com/packaging/folders/mp04a.html
U7 = LM1117IMPX-5.0/NOPB: 800mA Low-Dropout Linear Regulator, 4-pin SOT-223, Pb-Free; Manufacturer: National Semiconductor; PackageTopMarking: XYTT*N06B; PowerWise: N; CompType: LDO IC; Published: 1-Mar-2010; DatasheetVersion: Apr-2006; PackageVersion: revB, Apr-2003; PackageReference: MP04A; Publisher: Altium Limited; PackageDescription: Molded SOT-223, 6.50 x 3.56 x 1.6mm Body, 4 Lead, 2.3mm Pitch; Supplier 1: Digi-Key; Supplier Part Number 1: LM1117IMPX-5.0-ND; PartNumber: LM1117IMPX-5.0/NOPB; RoHS: Y; PinCount: 4; Code_JEDEC: TO-261-AA; Code_IPC: SOT223-4; ComponentLink1Description: LM1117 Datasheet; ComponentLink1URL: http://www.national.com/ds/LM/LM1117.pdf; ComponentLink2Description: LM1117 Web Page; ComponentLink2URL: http://www.national.com/pf/LM/LM1117.html; ComponentLink3Description: MP04A Package Page; ComponentLink3URL: http://www.national.com/packaging/folders/mp04a.html
U8 = TC1044SCOA: Charge Pump DC-TO-DC Voltage Converter, 8-Pin SOIC 150mil, Commercial Temperature; Published: 29-Jan-2009; DatasheetVersion: revA, Oct-2002; PackageVersion: revBB, Aug-2009; PackageReference: SOIC-OA8; Publisher: Altium Limited; PackageDescription: 8-Lead Plastic Small Outline (OA) - Narrow, 3.90mm Body [SOIC]; Supplier 1: Digi-Key; Supplier Part Number 1: TC1044SCOA-ND; Code_IPC: SOIC127P600-8; ComponentLink1Description: Datasheet; ComponentLink1URL: http://ww1.microchip.com/downloads/en/DeviceDoc/21348a.pdf; ComponentLink2Description: Packaging Specification; ComponentLink2URL: http://www.microchip.com/stellent/groups/techpub_sg/documents/packagingspec/en012702.pdf; ComponentLink3Description: Microchip.com Home; ComponentLink3URL: http://www.microchip.com/

## Nets that join several sheets
+3.3: MCU (11 pins), CODEC (11 pins), ISP (7 pins), LCD (7 pins), Alimentação (10 pins)
+5: ISP (5 pins), LCD (C61.1 P5.2 P5.4), Alimentação (7 pins)
GND: MCU (14 pins), CODEC (21 pins), ISP (23 pins), LCD (24 pins), Alimentação (26 pins)
NetC63_1: MCU (U5.46), LCD (C63.1 R35.1 SW2.2)
NetC64_1: MCU (U5.47), LCD (C64.1 R36.1 SW3.2)
NetD9_2: MCU (U5.52), LCD (D9.2 J1.8)
NetD10_2: MCU (U5.56), LCD (D10.2 J1.7)
NetD11_2: MCU (U5.59), LCD (D11.2 J1.5)
NetD12_2: MCU (U5.58), LCD (D12.2 J1.3)
NetD13_2: MCU (U5.50), LCD (D13.2 J1.2)
NetD14_2: MCU (U5.51), LCD (D14.2 J1.1)
NetJ1_11: MCU (U5.27), LCD (J1.11 R37.1)
NetLED1_2: MCU (U5.98), ISP (LED1.2 U4.5)
NetLED2_2: MCU (U5.32), ISP (LED2.2)
NetLED3_2: MCU (U5.99), ISP (LED3.2 U4.1)
NetP4_1: MCU (R33.2 U5.17), ISP (P4.1)
NetP4_3: MCU (U5.53), ISP (P4.3)
NetP5_13: MCU (U5.93), LCD (P5.13 TP4.1)
NetP5_15: MCU (U5.94), LCD (P5.15 TP3.1)
NetP5_19: MCU (U5.38), LCD (P5.19 TP10.1)
NetP5_21: MCU (U5.37), LCD (P5.21 TP9.1)
NetP5_23: MCU (U5.34), LCD (P5.23 TP8.1)
NetP5_24: MCU (U5.95), LCD (P5.24 TP7.1)
NetP5_26: MCU (U5.92), LCD (P5.26 TP6.1)
NetR17_2: MCU (U5.25), CODEC (R17.2 U3.27)
NetR18_2: MCU (U5.24), CODEC (R18.2 U3.28)
NetR29_1: MCU (U5.64), ISP (R29.1)
NetR30_1: MCU (R30.1 U5.81), CODEC (U3.5)
NetU3_6: MCU (U5.76), CODEC (U3.6)
NetU3_7: MCU (U5.77), CODEC (U3.7)
NetU3_8: MCU (U5.79), CODEC (U3.8)
NetU3_9: MCU (U5.80), CODEC (U3.9)
NetU3_23: MCU (U5.8), CODEC (U3.23)
NetU3_24: MCU (U5.9), CODEC (U3.24)
NetU4_19: MCU (U5.14), ISP (U4.19)
USB1_N: MCU (U5.30), ISP (C32.1 R25.1)
USB1_P: MCU (U5.29), ISP (C33.1 R26.1)